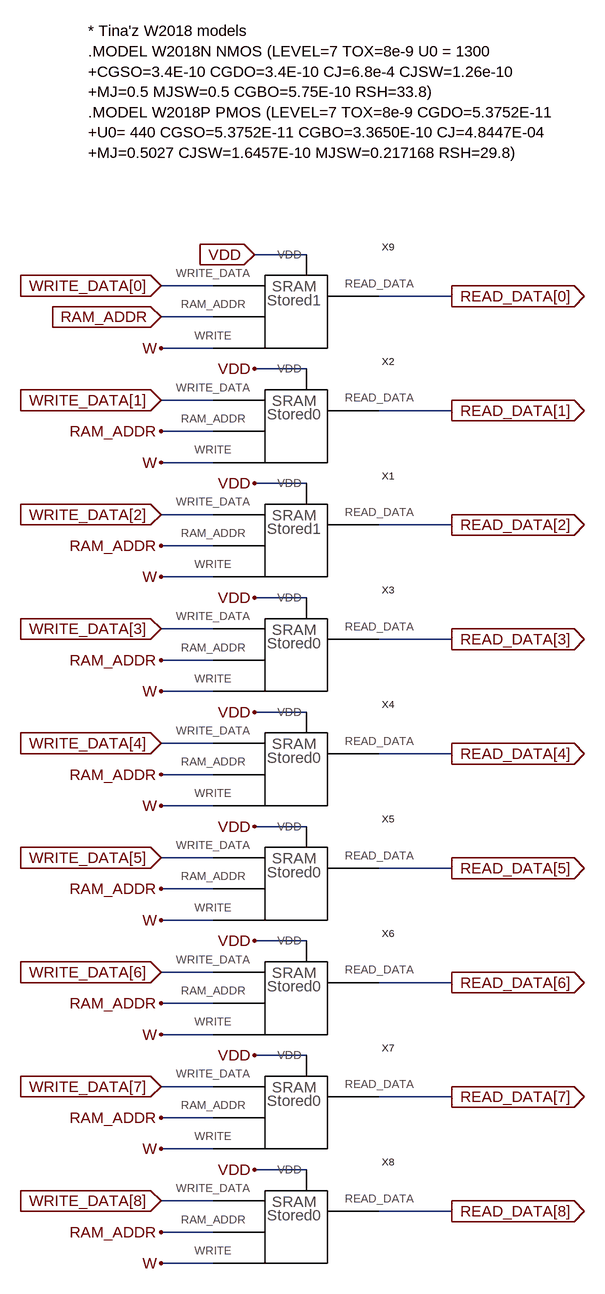
[diagram p0: schematic SRAM_cellsramtzAddr1.asc]
SRAM_cellsramtzAddr1.asc, the LTspice schematic file:
Version 4
SHEET 1 880 1532
WIRE 352 -80 272 -80
WIRE 208 -32 128 -32
WIRE 576 -16 464 -16
WIRE 208 16 128 16
WIRE 208 64 128 64
WIRE 352 96 272 96
WIRE 208 144 128 144
WIRE 576 160 464 160
WIRE 208 192 128 192
WIRE 208 240 128 240
WIRE 352 272 272 272
WIRE 208 320 128 320
WIRE 576 336 464 336
WIRE 208 368 128 368
WIRE 208 416 128 416
WIRE 352 448 272 448
WIRE 208 496 128 496
WIRE 576 512 464 512
WIRE 208 544 128 544
WIRE 208 592 128 592
WIRE 352 624 272 624
WIRE 208 672 128 672
WIRE 576 688 464 688
WIRE 208 720 128 720
WIRE 208 768 128 768
WIRE 352 800 272 800
WIRE 208 848 128 848
WIRE 576 864 464 864
WIRE 208 896 128 896
WIRE 208 944 128 944
WIRE 352 976 272 976
WIRE 208 1024 128 1024
WIRE 576 1040 464 1040
WIRE 208 1072 128 1072
WIRE 208 1120 128 1120
WIRE 352 1152 272 1152
WIRE 208 1200 128 1200
WIRE 576 1216 464 1216
WIRE 208 1248 128 1248
WIRE 208 1296 128 1296
WIRE 352 1328 272 1328
WIRE 208 1376 128 1376
WIRE 576 1392 464 1392
WIRE 208 1424 128 1424
WIRE 208 1472 128 1472
FLAG 272 96 VDD
FLAG 128 144 WRITE_DATA[1]
IOPIN 128 144 In
FLAG 128 192 RAM_ADDR
FLAG 128 240 W
FLAG 272 272 VDD
FLAG 128 320 WRITE_DATA[2]
IOPIN 128 320 In
FLAG 128 368 RAM_ADDR
FLAG 128 416 W
FLAG 272 448 VDD
FLAG 128 496 WRITE_DATA[3]
IOPIN 128 496 In
FLAG 128 544 RAM_ADDR
FLAG 128 592 W
FLAG 272 624 VDD
FLAG 128 672 WRITE_DATA[4]
IOPIN 128 672 In
FLAG 128 720 RAM_ADDR
FLAG 128 768 W
FLAG 272 800 VDD
FLAG 128 848 WRITE_DATA[5]
IOPIN 128 848 In
FLAG 128 896 RAM_ADDR
FLAG 128 944 W
FLAG 272 976 VDD
FLAG 128 1024 WRITE_DATA[6]
IOPIN 128 1024 In
FLAG 128 1072 RAM_ADDR
FLAG 128 1120 W
FLAG 272 1152 VDD
FLAG 128 1200 WRITE_DATA[7]
IOPIN 128 1200 In
FLAG 128 1248 RAM_ADDR
FLAG 128 1296 W
FLAG 272 1328 VDD
FLAG 128 1376 WRITE_DATA[8]
IOPIN 128 1376 In
FLAG 128 1424 RAM_ADDR
FLAG 128 1472 W
FLAG 272 -80 VDD
IOPIN 272 -80 In
FLAG 128 -32 WRITE_DATA[0]
IOPIN 128 -32 In
FLAG 128 16 RAM_ADDR
IOPIN 128 16 In
FLAG 128 64 W
FLAG 576 -16 READ_DATA[0]
IOPIN 576 -16 Out
FLAG 576 160 READ_DATA[1]
IOPIN 576 160 Out
FLAG 576 336 READ_DATA[2]
IOPIN 576 336 Out
FLAG 576 512 READ_DATA[3]
IOPIN 576 512 Out
FLAG 576 688 READ_DATA[4]
IOPIN 576 688 Out
FLAG 576 864 READ_DATA[5]
IOPIN 576 864 Out
FLAG 576 1040 READ_DATA[6]
IOPIN 576 1040 Out
FLAG 576 1216 READ_DATA[7]
IOPIN 576 1216 Out
FLAG 576 1392 READ_DATA[8]
IOPIN 576 1392 Out
SYMBOL SRAM_cellsramtz1 320 0 R0
SYMATTR InstName X9
SYMBOL SRAM_cellsramtz0 320 528 R0
SYMATTR InstName X3
SYMBOL SRAM_cellsramtz0 320 704 R0
SYMATTR InstName X4
SYMBOL SRAM_cellsramtz0 320 880 R0
SYMATTR InstName X5
SYMBOL SRAM_cellsramtz0 320 1056 R0
SYMATTR InstName X6
SYMBOL SRAM_cellsramtz0 320 1232 R0
SYMATTR InstName X7
SYMBOL SRAM_cellsramtz0 320 1408 R0
SYMATTR InstName X8
SYMBOL SRAM_cellsramtz1 320 352 R0
SYMATTR InstName X1
SYMBOL SRAM_cellsramtz0 320 176 R0
SYMATTR InstName X2
TEXT 16 -424 Left 2 !* Tina'z W2018 models\n.MODEL W2018N NMOS (LEVEL=7 TOX=8e-9 U0 = 1300\n+CGSO=3.4E-10 CGDO=3.4E-10 CJ=6.8e-4 CJSW=1.26e-10\n+MJ=0.5 MJSW=0.5 CGBO=5.75E-10 RSH=33.8)\n.MODEL W2018P PMOS (LEVEL=7 TOX=8e-9 CGDO=5.3752E-11\n+U0= 440 CGSO=5.3752E-11 CGBO=3.3650E-10 CJ=4.8447E-04\n+MJ=0.5027 CJSW=1.6457E-10 MJSW=0.217168 RSH=29.8)

The netlist it stands for:
* SRAM_cellsramtzAddr1.asc
XX9 VDD READ_DATA[0] WRITE_DATA[0] RAM_ADDR W SRAM_cellsramtz1  ; pins VDD READ_DATA WRITE_DATA RAM_ADDR WRITE
XX3 VDD READ_DATA[3] WRITE_DATA[3] RAM_ADDR W SRAM_cellsramtz0  ; pins VDD READ_DATA WRITE_DATA RAM_ADDR WRITE
XX4 VDD READ_DATA[4] WRITE_DATA[4] RAM_ADDR W SRAM_cellsramtz0  ; pins VDD READ_DATA WRITE_DATA RAM_ADDR WRITE
XX5 VDD READ_DATA[5] WRITE_DATA[5] RAM_ADDR W SRAM_cellsramtz0  ; pins VDD READ_DATA WRITE_DATA RAM_ADDR WRITE
XX6 VDD READ_DATA[6] WRITE_DATA[6] RAM_ADDR W SRAM_cellsramtz0  ; pins VDD READ_DATA WRITE_DATA RAM_ADDR WRITE
XX7 VDD READ_DATA[7] WRITE_DATA[7] RAM_ADDR W SRAM_cellsramtz0  ; pins VDD READ_DATA WRITE_DATA RAM_ADDR WRITE
XX8 VDD READ_DATA[8] WRITE_DATA[8] RAM_ADDR W SRAM_cellsramtz0  ; pins VDD READ_DATA WRITE_DATA RAM_ADDR WRITE
XX1 VDD READ_DATA[2] WRITE_DATA[2] RAM_ADDR W SRAM_cellsramtz1  ; pins VDD READ_DATA WRITE_DATA RAM_ADDR WRITE
XX2 VDD READ_DATA[1] WRITE_DATA[1] RAM_ADDR W SRAM_cellsramtz0  ; pins VDD READ_DATA WRITE_DATA RAM_ADDR WRITE
* Tina'z W2018 models
.MODEL W2018N NMOS (LEVEL=7 TOX=8e-9 U0 = 1300
+CGSO=3.4E-10 CGDO=3.4E-10 CJ=6.8e-4 CJSW=1.26e-10
+MJ=0.5 MJSW=0.5 CGBO=5.75E-10 RSH=33.8)
.MODEL W2018P PMOS (LEVEL=7 TOX=8e-9 CGDO=5.3752E-11
+U0= 440 CGSO=5.3752E-11 CGBO=3.3650E-10 CJ=4.8447E-04
+MJ=0.5027 CJSW=1.6457E-10 MJSW=0.217168 RSH=29.8)
.backanno
.end